# Altium schematic sheet ESPDIV-v1 schematic.SchDoc
size 355 x 177 mm; Organization: Altium Limited; Address1: L3, 12a Rodborough Rd; Address2: Frenchs Forest; Address3: NSW; Address4: Australia 2086
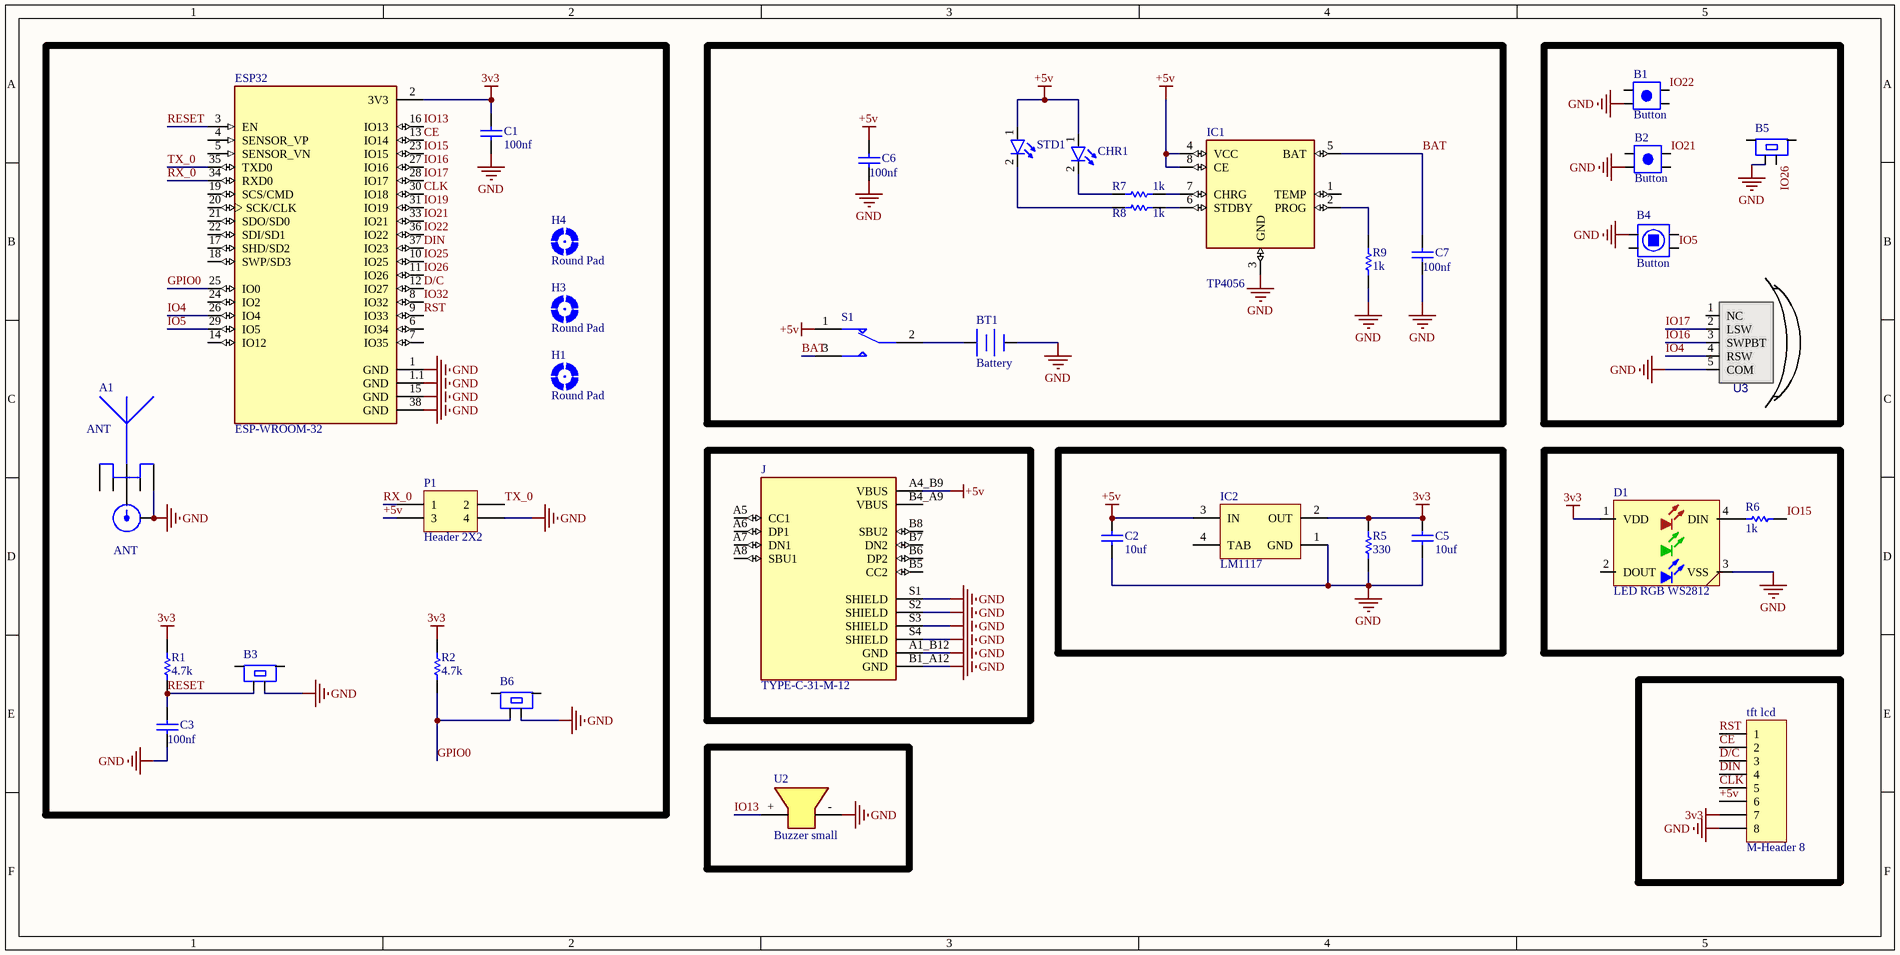
[diagram p0: ESPDIV-v1 schematic.SchDoc]

## Parts
A1  ANT  [SMA RIGHT]
ANT  ANT U.FL  [U.FL SMD]  (value not drawn)
B1  Button  [PUSH BUTTON 4 PIN SMD 5]
B2  Button  [PUSH BUTTON 4 PIN SMD 5]
B3  BUTTON  [PUSH BUTTON SMD]  (value not drawn)
B4  Button  [PUSH BUTTON 12*12*8.5mm]
B5  BUTTON  [PUSH BUTTON SMD]  (value not drawn)
B6  BUTTON  [PUSH BUTTON SMD]  (value not drawn)
BT1  Battery  [Bat]
C1  100nf  [CAP0805]
C2  10uf  [CAP0805]
C3  100nf  [CAP0805]
C5  10uf  [CAP0805]
C6  100nf  [CAP0805]
C7  100nf  [CAP0805]
CHR1  Red  [LED SMD 1206]  (value not drawn)
D1  LED RGB WS2812  [LED 5050 WS2812B]
ESP32  ESP-WROOM-32  [MODULE_ESP-WROOM-32]
H1  Round Pad  [P3.0C]  (no BOM)
H3  Round Pad  [P3.0C]  (no BOM)
H4  Round Pad  [P3.0C]  (no BOM)
IC1  TP4056  [SOP-8]
IC2  LM1117  [MP04A_M]
J  TYPE-C-31-M-12  [HRO_TYPE-C-31-M-12]
P1  Header 2X2  [HDR2X2]
R1  4.7k  [RES 0805]
R2  4.7k  [RES 0805]
R5  330  [RES 0805 (2012X06L)]
R6  1k  [RES 0805]
R7  1k  [RES 0805]
R8  1k  [RES 0805]
R9  1k  [RES 0805]
S1  1437566-3  [Subminiator SPDT switch]  (value not drawn)
STD1  Red  [LED SMD 1206]  (value not drawn)
tft_lcd  M-Header 8  [M-Header 8]
U2  Buzzer small  [BUZZER]
U3  CrescentSwitch  [SWCRE_SMD_13X13]  (value not drawn)

## Nets
3v3: C1.1 C5.2 D1.1(VDD) ESP32.2(3V3) IC2.2(OUT) R1.2 R2.2 R5.2 tft_lcd.7
+5v: C2.2 C6.2 CHR1.1(A) IC1.4(VCC) IC1.8(CE) IC2.3(IN) J.A4_B9(VBUS) P1.3 S1.1 STD1.1(A) tft_lcd.6
GND: A1.1 ANT.2 B1.4 B2.4 B3.2 B4.3 B5.3 B6.2 BT1.2(-) C1.2 C2.1 C3.1 C5.1 C6.1 C7.1 D1.3(VSS) ESP32.1(GND) ESP32.1.1(GND) ESP32.15(GND) ESP32.38(GND) IC1.3(GND) IC2.1(GND) J.A1_B12(GND) J.B1_A12(GND) J.S1(SHIELD) J.S2(SHIELD) J.S3(SHIELD) J.S4(SHIELD) P1.4 R5.1 R9.2 tft_lcd.8 U2.- U3.5(COM)
SHIELD: H1.P H3.P H4.P
BAT: C7.2 IC1.5(BAT) S1.3
CE: ESP32.13(IO14) tft_lcd.2
CLK: ESP32.30(IO18) tft_lcd.5
D/C: ESP32.12(IO27) tft_lcd.3
DIN: ESP32.37(IO23) tft_lcd.4
GPIO0: B6.3 ESP32.25(IO0) R2.1
IO4: ESP32.26(IO4) U3.4(RSW)
IO5: B4.1 ESP32.29(IO5)
IO13: ESP32.16(IO13) U2.+
IO15: ESP32.23(IO15) R6.1
IO16: ESP32.27(IO16) U3.3(SWPBT)
IO17: ESP32.28(IO17) U3.2(LSW)
IO19: ESP32.31(IO19)
IO21: B2.2 ESP32.33(IO21)
IO22: B1.2 ESP32.36(IO22)
IO25: ESP32.10(IO25)
IO26: B5.2 ESP32.11(IO26)
IO32: ESP32.8(IO32)
RESET: B3.3 C3.2 ESP32.3(EN) R1.1
RST: ESP32.9(IO33) tft_lcd.1
RX_0: ESP32.34(RXD0) P1.1
TX_0: ESP32.35(TXD0) P1.2
NetA1_5: A1.5 ANT.1
NetBT1_1: BT1.1(+) S1.2
NetCHR1_2: CHR1.2(K) R7.2
NetD1_4: D1.4(DIN) R6.2
NetIC1_2: IC1.2(PROG) R9.1
NetIC1_6: IC1.6(STDBY) R8.1
NetIC1_7: IC1.7(CHRG) R7.1
NetR8_2: R8.2 STD1.2(K)

Not connected (* = marked no-connect by the designer): A1 2 3 4; B1 1 3; B2 1 3; B3 1 4; B4 2 4; B5 1 4; B6 1 4; D1 2(DOUT); ESP32 4(SENSOR_VP) 5(SENSOR_VN) 6(IO34) 7(IO35) 14(IO12) 17(SHD/SD2) 18(SWP/SD3) 19(SCS/CMD) 20(SCK/CLK) 21(SDO/SD0) 22(SDI/SD1) 24(IO2); IC1 1(TEMP); IC2 4(TAB); J A5(CC1) A6(DP1) A7(DN1) A8(SBU1) B4_A9(VBUS) B5(CC2) B6(DP2) B7(DN2) B8(SBU2); U3 1(NC)

## Notes on the sheet
- Title
- Size:
- Date:
- B
- Number:
- Time:
- Revision:
- Sheet
- of
- File:

## Library data of the parts
A1 = SMA - ANTENA: ANTENA
ANT = ANT U.FL: Antenna; Ali Hafizi: Ali Hafizi
B1 B2 = PUSH BUTTON 4 PIN: PUSH BUTTON
B3 B5 B6 = PUSH BUTTON RIGHT: PUSH BUTTON
B4 = TACTILE SWITCH
C1-C3 C5-C7 = CAP SMD: Capacitor
CHR1 STD1 = LED: Designer: Saeid Jorablo; Organazation: ControTec; Adding Date: 1387/12/22; Color: Red; Size: SMD 1206
D1 = LED RGB WS2812: LED
ESP32 = ESP-WROOM-32: WiFi 802.11b/g/n/d/e/i Transceiver Module 2.4GHz Surface Mount; MF: Olimex LTD; Value: *; SnapEDA_Link: https://www.snapeda.com/parts/ESP-WROOM-32/Olimex%20LTD/view-part/2311927/?ref=snap; MP: ESP-WROOM-32; Availability: Unavailable; Price: None; Package: Module Olimex LTD
H1 H3 H4 = MOUNT-PAD-ROUND: MOUNTING PAD, round
IC1 = TP4056: Complete single cell Li-Ion battery with a constant current / constant voltage linear charger; MF: NanJing Top Power ASIC Corp.; Package: Package Analog Devices; MP: TP4056; Value: *; SnapEDA_Link: https://www.snapeda.com/parts/TP4056%20/NanJing%20Top%20Power%20ASIC%20Corp./view-part/2888426/?ref=snap; Price: None; Availability: Unavailable
IC2 = LM1117IMP-x.x: x.x Volt, 800mA Low-Dropout Linear Regulator, 4-pin SOT-223; PartNumber: LM1117IMP-3.3; Manufacturer: National Semiconductor; PackageTopMarking: XYTT*N05B; PowerWise: N; CompType: LDO IC; Published: 4-Dec-2008; DatasheetVersion: Apr-2006; PackageVersion: revB, Apr-2003; PackageReference: MP04A; Publisher: Altium Limited; PackageDescription: Molded SOT-223, 6.50 x 3.56 x 1.6mm Body, 4 Lead, 2.3mm Pitch; Supplier 1: Farnell; Supplier Part Number 1: 7614123; RoHS: N; PinCount: 4; Code_JEDEC: TO-261-AA; Code_IPC: SOT223-4; ComponentLink1Description: LM1117 Datasheet; ComponentLink1URL: http://www.national.com/ds/LM/LM1117.pdf; ComponentLink2Description: LM1117 Web Page; ComponentLink2URL: http://www.national.com/pf/LM/LM1117.html; ComponentLink3Description: MP04A Package Page; ComponentLink3URL: http://www.national.com/packaging/folders/mp04a.html
J = TYPE-C-31-M-12: USB Connectors 24 Receptacle 1 8.94*7.3mm RoHS; MF: HRO Electronics Co., Ltd.; Price: None; Value: *; SnapEDA_Link: https://www.snapeda.com/parts/TYPE-C-31-M-12/HRO+Electronics+Co.%252C+Ltd./view-part/?ref=snap; Package: Package; Availability: Not in stock; Check_prices: https://www.snapeda.com/parts/TYPE-C-31-M-12/HRO+Electronics+Co.%252C+Ltd./view-part/?ref=eda; MP: TYPE-C-31-M-12
P1 = Header 2X2: Header, 2-Pin, Dual row; LatestRevisionDate: 17-Jul-2002; LatestRevisionNote: Re-released for DXP Platform.; Publisher: Altium Limited
R1 R2 R5-R9 = RES: RESISTOR
S1 = Subminiator SPDT switch
U2 = Buzzer: 5-12v small buzzer (12mm)
U3 = SWCRE_SMD_13X13: SWITCH, CRESCENT, 13X13mm, SMD; DESIGN BY: A-SHAMSAEI; VALUE: CrescentSwitch; PARAM: PARAM; PARAM2: PARAM2